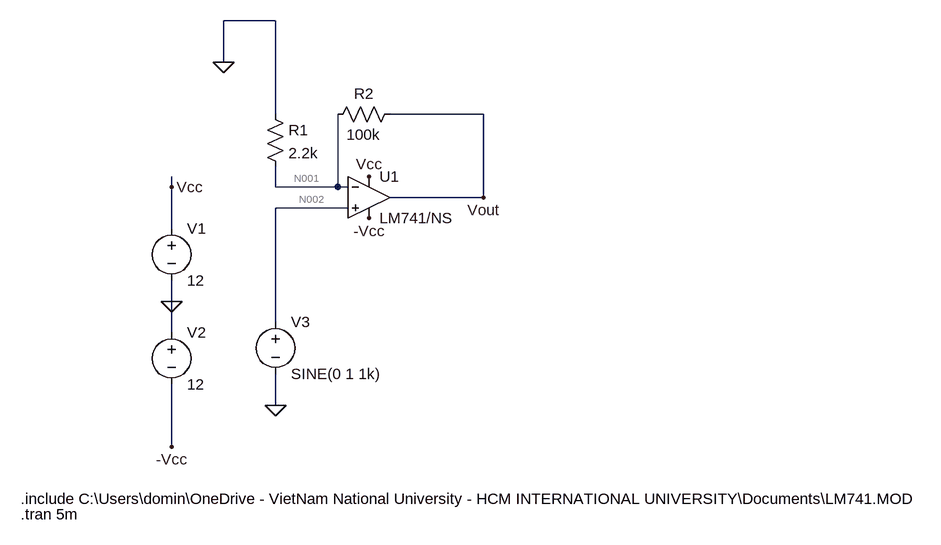
[diagram p0: schematic Draft3.asc]
Draft3.asc, the LTspice schematic file:
Version 4
SHEET 1 988 680
WIRE -112 -128 -192 -128
WIRE -192 -64 -192 -128
WIRE -112 16 -112 -128
WIRE 208 16 64 16
WIRE -272 128 -272 112
WIRE -112 128 -112 96
WIRE -16 128 -16 16
WIRE -16 128 -112 128
WIRE 0 128 -16 128
WIRE 208 144 208 16
WIRE 208 144 64 144
WIRE 0 160 -112 160
WIRE -272 192 -272 128
WIRE -272 304 -272 272
WIRE -112 336 -112 160
WIRE -272 352 -272 304
WIRE -112 464 -112 416
WIRE -272 528 -272 432
FLAG -272 304 0
FLAG -272 128 Vcc
FLAG -272 528 -Vcc
FLAG 32 112 Vcc
FLAG 32 176 -Vcc
FLAG -112 464 0
FLAG -192 -64 0
FLAG 208 144 Vout
SYMBOL voltage -272 176 R0
WINDOW 123 0 0 Left 0
WINDOW 39 0 0 Left 0
SYMATTR InstName V1
SYMATTR Value 12
SYMBOL OpAmps\\opamp2 32 80 R0
SYMATTR InstName U1
SYMATTR Value LM741/NS
SYMBOL voltage -272 336 R0
WINDOW 123 0 0 Left 0
WINDOW 39 0 0 Left 0
SYMATTR InstName V2
SYMATTR Value 12
SYMBOL voltage -112 320 R0
WINDOW 123 0 0 Left 0
WINDOW 39 0 0 Left 0
SYMATTR InstName V3
SYMATTR Value SINE(0 1 1k)
SYMBOL res -128 0 R0
SYMATTR InstName R1
SYMATTR Value 2.2k
SYMBOL res 80 0 R90
WINDOW 0 0 56 VBottom 2
WINDOW 3 32 56 VTop 2
SYMATTR InstName R2
SYMATTR Value 100k
TEXT -504 608 Left 2 !.include C:\\Users\\domin\\OneDrive - VietNam National University - HCM INTERNATIONAL UNIVERSITY\\Documents\\LM741.MOD
TEXT -504 632 Left 2 !.tran 5m

The netlist it stands for:
* Draft3.asc
V1 Vcc 0 12
XU1 N002 N001 Vcc -Vcc Vout LM741/NS  ; pins In+ In- V+ V- OUT
V2 0 -Vcc 12
V3 N002 0 SINE(0 1 1k)
R1 0 N001 2.2k
R2 Vout N001 100k
.include C:\Users\domin\OneDrive - VietNam National University - HCM INTERNATIONAL UNIVERSITY\Documents\LM741.MOD
.tran 5m
.backanno
.end

* Results of the author's LTspice run, read from the files saved beside the schematic
* Operating Point, zero values left out:
*   V(vcc) = 12 V
*   V(n001) = 999.7 µV
*   V(-vcc) = -12 V
*   V(vout) = 56.63 mV
*   I(R1) = -454.4 nA
*   I(R2) = 556.3 nA
*   I(V1) = -1.626 mA
*   I(V2) = -1.626 mA
*   I(V3) = -57.86 nA
*   Ix(u1:1) = 57.86 nA
*   Ix(u1:2) = 101.9 nA
*   Ix(u1:99) = 1.626 mA
*   Ix(u1:50) = -1.626 mA
*   Ix(u1:28) = -556.3 nA
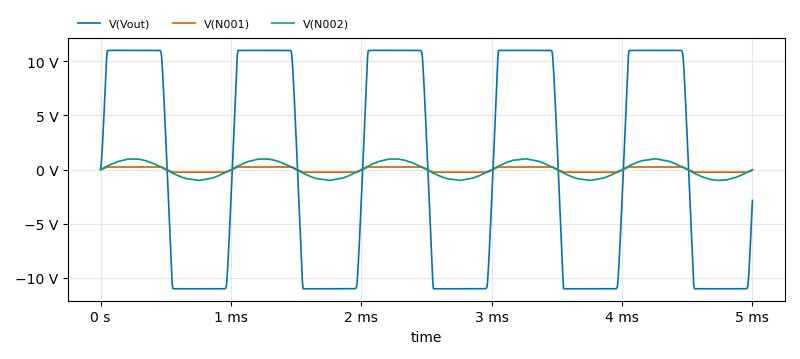
[diagram p1: Transient Analysis of Draft3.asc, plotted from the saved traces]
* Transient Analysis, 1 run:
*   V(Vout): min -11.01 V, max 11.01 V, average 17.41 mV, rms 10.4 V, last -2.849 V
*   V(N001): min -240.6 mV, max 240.2 mV, average 162.6 µV, rms 225.8 mV, last -61.13 mV
*   V(N002): min -998.2 mV, max 998 mV, average 849.2 µV, rms 696 mV, last 0 V